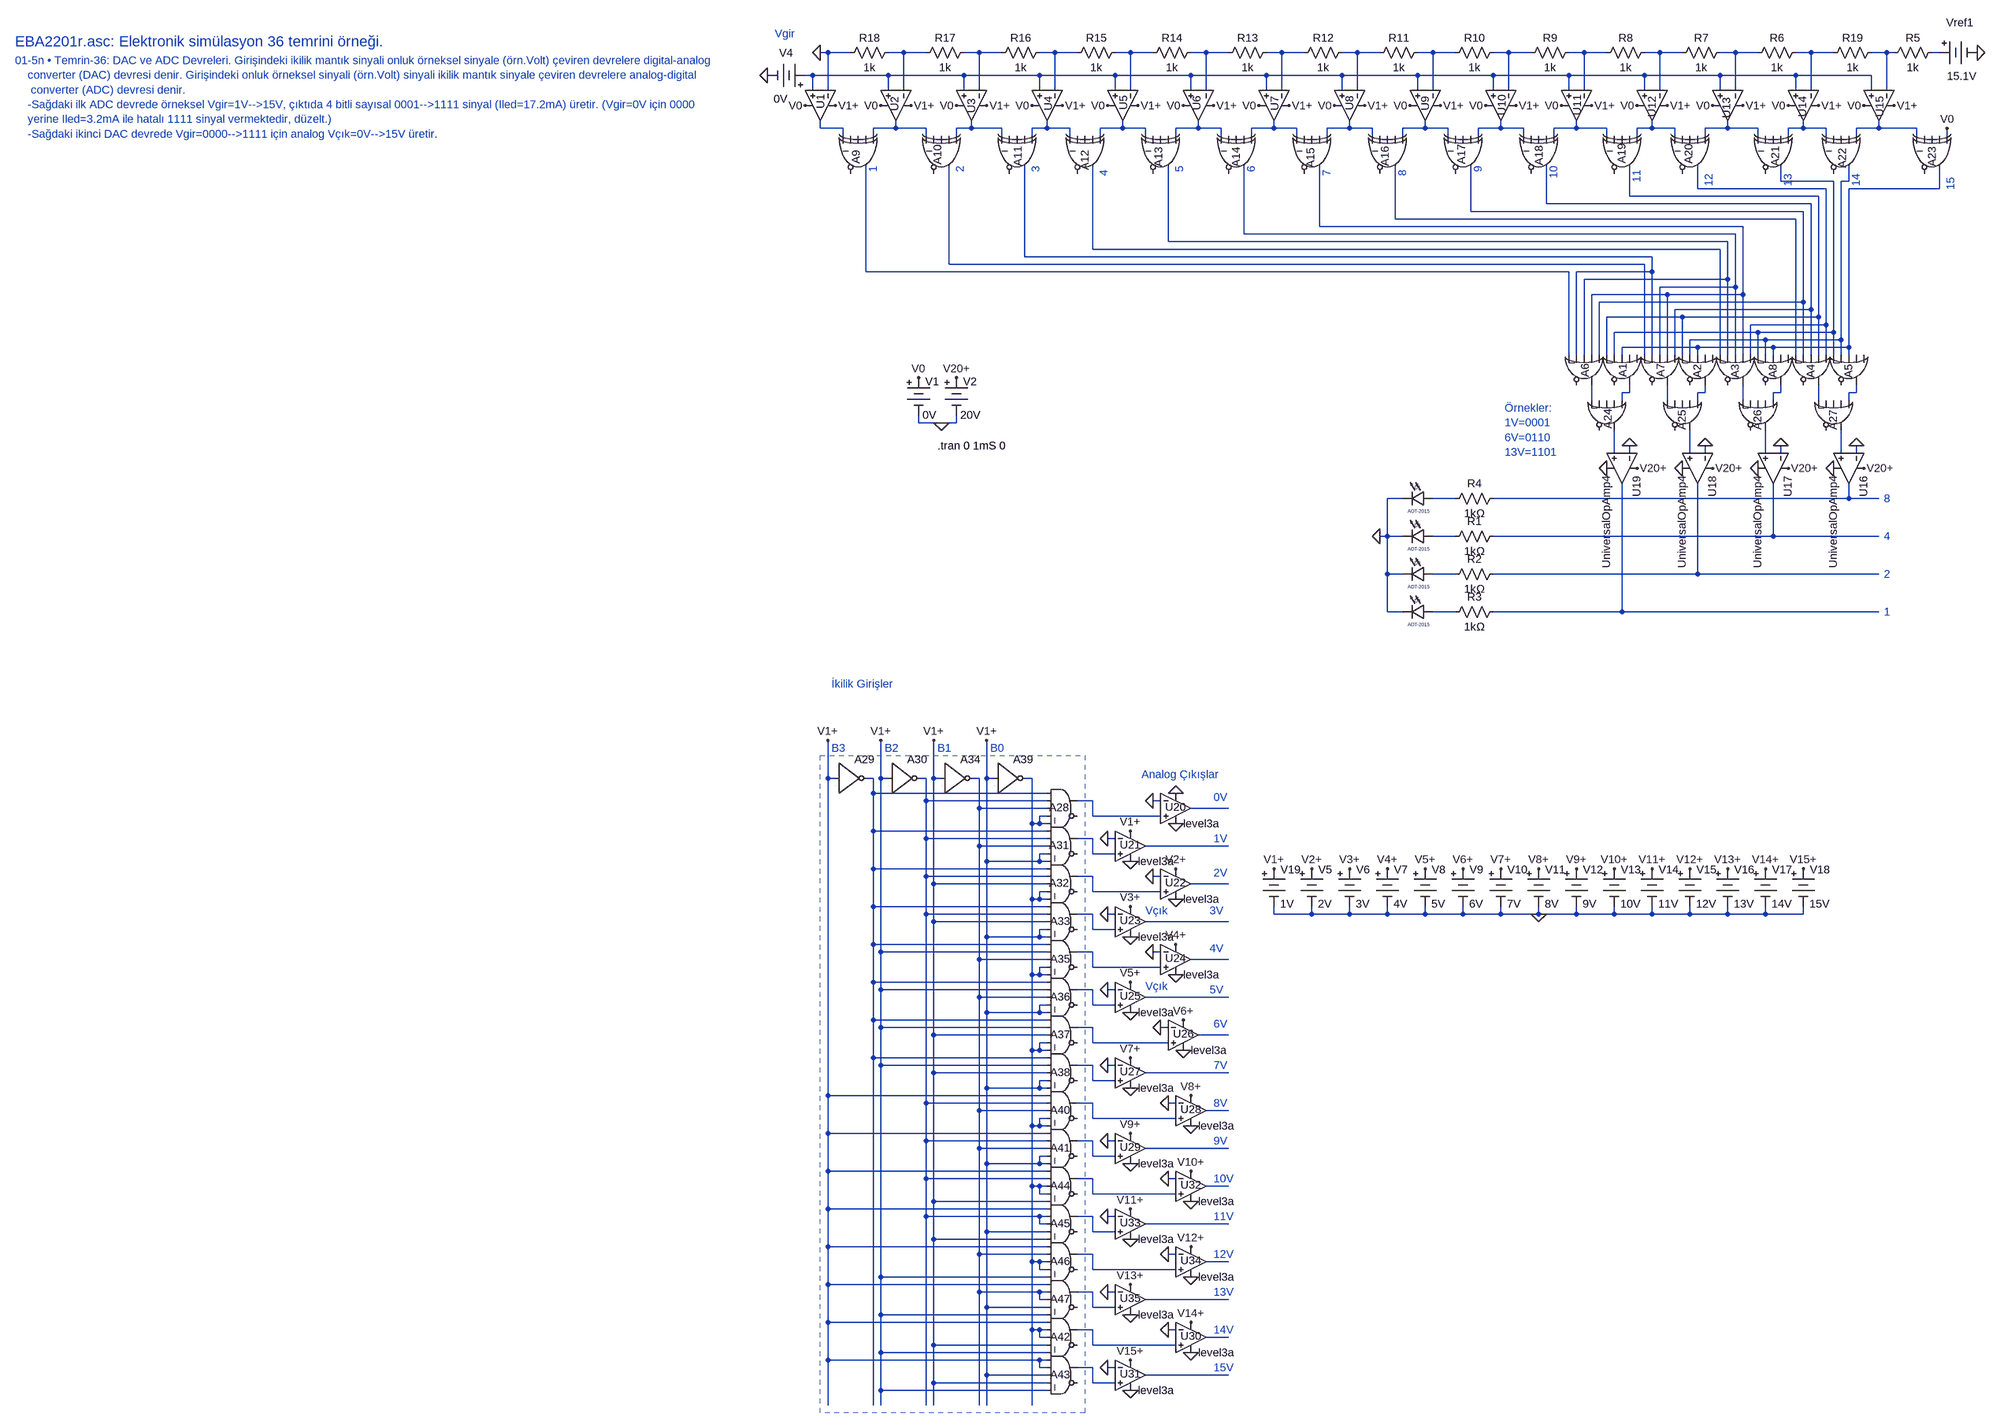
[diagram p0: schematic EBA2201r.asc]
EBA2201r.asc, the LTspice schematic file:
Version 4
SHEET 1 7064 4332
WIRE 1776 80 1760 80
WIRE 1824 80 1776 80
WIRE 1936 80 1904 80
WIRE 1984 80 1936 80
WIRE 2096 80 2064 80
WIRE 2144 80 2096 80
WIRE 2256 80 2224 80
WIRE 2304 80 2256 80
WIRE 2416 80 2384 80
WIRE 2464 80 2416 80
WIRE 2576 80 2544 80
WIRE 2624 80 2576 80
WIRE 2736 80 2704 80
WIRE 2784 80 2736 80
WIRE 2896 80 2864 80
WIRE 2944 80 2896 80
WIRE 3056 80 3024 80
WIRE 3104 80 3056 80
WIRE 3216 80 3184 80
WIRE 3264 80 3216 80
WIRE 3376 80 3344 80
WIRE 3424 80 3376 80
WIRE 3536 80 3504 80
WIRE 3584 80 3536 80
WIRE 3696 80 3664 80
WIRE 3744 80 3696 80
WIRE 3856 80 3824 80
WIRE 3904 80 3856 80
WIRE 4016 80 3984 80
WIRE 4032 80 4016 80
WIRE 4128 80 4112 80
WIRE 1744 128 1728 128
WIRE 1904 128 1744 128
WIRE 2064 128 1904 128
WIRE 2224 128 2064 128
WIRE 2384 128 2224 128
WIRE 2544 128 2384 128
WIRE 2704 128 2544 128
WIRE 2864 128 2704 128
WIRE 3024 128 2864 128
WIRE 3184 128 3024 128
WIRE 3344 128 3184 128
WIRE 3504 128 3344 128
WIRE 3664 128 3504 128
WIRE 3824 128 3664 128
WIRE 3984 128 3824 128
WIRE 1744 160 1744 128
WIRE 1776 160 1776 80
WIRE 1904 160 1904 128
WIRE 1936 160 1936 80
WIRE 2064 160 2064 128
WIRE 2096 160 2096 80
WIRE 2224 160 2224 128
WIRE 2256 160 2256 80
WIRE 2384 160 2384 128
WIRE 2416 160 2416 80
WIRE 2544 160 2544 128
WIRE 2576 160 2576 80
WIRE 2704 160 2704 128
WIRE 2736 160 2736 80
WIRE 2864 160 2864 128
WIRE 2896 160 2896 80
WIRE 3024 160 3024 128
WIRE 3056 160 3056 80
WIRE 3184 160 3184 128
WIRE 3216 160 3216 80
WIRE 3344 160 3344 128
WIRE 3376 160 3376 80
WIRE 3504 160 3504 128
WIRE 3536 160 3536 80
WIRE 3664 160 3664 128
WIRE 3696 160 3696 80
WIRE 3824 160 3824 128
WIRE 3856 160 3856 80
WIRE 3984 160 3984 128
WIRE 4016 160 4016 80
WIRE 1760 240 1760 224
WIRE 1808 240 1760 240
WIRE 1920 240 1920 224
WIRE 1920 240 1872 240
WIRE 1984 240 1920 240
WIRE 2080 240 2080 224
WIRE 2080 240 2048 240
WIRE 2144 240 2080 240
WIRE 2240 240 2240 224
WIRE 2240 240 2208 240
WIRE 2288 240 2240 240
WIRE 2400 240 2400 224
WIRE 2400 240 2352 240
WIRE 2448 240 2400 240
WIRE 2560 240 2560 224
WIRE 2560 240 2512 240
WIRE 2608 240 2560 240
WIRE 2720 240 2720 224
WIRE 2720 240 2672 240
WIRE 2768 240 2720 240
WIRE 2880 240 2880 224
WIRE 2880 240 2832 240
WIRE 2928 240 2880 240
WIRE 3040 240 3040 224
WIRE 3040 240 2992 240
WIRE 3088 240 3040 240
WIRE 3200 240 3200 224
WIRE 3200 240 3152 240
WIRE 3248 240 3200 240
WIRE 3360 240 3360 224
WIRE 3360 240 3312 240
WIRE 3424 240 3360 240
WIRE 3520 240 3520 224
WIRE 3520 240 3488 240
WIRE 3568 240 3520 240
WIRE 3680 240 3680 224
WIRE 3680 240 3632 240
WIRE 3744 240 3680 240
WIRE 3840 240 3840 224
WIRE 3840 240 3808 240
WIRE 3888 240 3840 240
WIRE 4000 240 4000 224
WIRE 4000 240 3952 240
WIRE 4080 240 4000 240
WIRE 1808 256 1808 240
WIRE 1872 256 1872 240
WIRE 1984 256 1984 240
WIRE 2048 256 2048 240
WIRE 2144 256 2144 240
WIRE 2208 256 2208 240
WIRE 2288 256 2288 240
WIRE 2352 256 2352 240
WIRE 2448 256 2448 240
WIRE 2512 256 2512 240
WIRE 2608 256 2608 240
WIRE 2672 256 2672 240
WIRE 2768 256 2768 240
WIRE 2832 256 2832 240
WIRE 2928 256 2928 240
WIRE 2992 256 2992 240
WIRE 3088 256 3088 240
WIRE 3152 256 3152 240
WIRE 3248 256 3248 240
WIRE 3312 256 3312 240
WIRE 3424 256 3424 240
WIRE 3488 256 3488 240
WIRE 3568 256 3568 240
WIRE 3632 256 3632 240
WIRE 3744 256 3744 240
WIRE 3808 256 3808 240
WIRE 3888 256 3888 240
WIRE 3952 256 3952 240
WIRE 4080 256 4080 240
WIRE 4144 256 4144 240
WIRE 3792 352 3792 320
WIRE 3904 352 3792 352
WIRE 3936 352 3936 320
WIRE 3936 352 3920 352
WIRE 3616 368 3616 320
WIRE 3888 368 3616 368
WIRE 4128 368 4128 320
WIRE 4128 368 3936 368
WIRE 3472 384 3472 320
WIRE 3872 384 3472 384
WIRE 3296 400 3296 320
WIRE 3856 400 3296 400
WIRE 3136 416 3136 320
WIRE 3840 416 3136 416
WIRE 2976 432 2976 320
WIRE 3824 432 2976 432
WIRE 2816 448 2816 320
WIRE 3712 448 2816 448
WIRE 2656 464 2656 320
WIRE 3696 464 2656 464
WIRE 2496 480 2496 320
WIRE 3680 480 2496 480
WIRE 2336 496 2336 320
WIRE 3664 496 2336 496
WIRE 2192 512 2192 320
WIRE 3520 512 2192 512
WIRE 2032 528 2032 320
WIRE 3504 528 2032 528
WIRE 1856 544 1856 320
WIRE 3344 544 1856 544
WIRE 3520 544 3520 512
WIRE 3520 544 3360 544
WIRE 3680 560 3680 480
WIRE 3680 560 3376 560
WIRE 3696 576 3696 464
WIRE 3696 576 3536 576
WIRE 3552 592 3392 592
WIRE 3712 592 3712 448
WIRE 3712 592 3552 592
WIRE 3840 608 3840 416
WIRE 3840 608 3408 608
WIRE 3856 624 3856 400
WIRE 3856 624 3568 624
WIRE 3584 640 3424 640
WIRE 3872 640 3872 384
WIRE 3872 640 3584 640
WIRE 3888 656 3888 368
WIRE 3888 656 3728 656
WIRE 3744 672 3440 672
WIRE 3904 672 3904 352
WIRE 3904 672 3744 672
WIRE 3760 688 3600 688
WIRE 3920 688 3920 352
WIRE 3920 688 3760 688
WIRE 3616 704 3456 704
WIRE 3776 704 3616 704
WIRE 3936 704 3936 368
WIRE 3936 704 3776 704
WIRE 3344 720 3344 544
WIRE 3360 720 3360 544
WIRE 3376 720 3376 560
WIRE 3392 720 3392 592
WIRE 3408 720 3408 608
WIRE 3424 720 3424 640
WIRE 3440 720 3440 672
WIRE 3456 720 3456 704
WIRE 3504 720 3504 528
WIRE 3520 720 3520 544
WIRE 3536 720 3536 576
WIRE 3552 720 3552 592
WIRE 3568 720 3568 624
WIRE 3584 720 3584 640
WIRE 3600 720 3600 688
WIRE 3616 720 3616 704
WIRE 3664 720 3664 496
WIRE 3680 720 3680 560
WIRE 3696 720 3696 576
WIRE 3712 720 3712 592
WIRE 3728 720 3728 656
WIRE 3744 720 3744 672
WIRE 3760 720 3760 688
WIRE 3776 720 3776 704
WIRE 3824 720 3824 432
WIRE 3840 720 3840 608
WIRE 3856 720 3856 624
WIRE 3872 720 3872 640
WIRE 3888 720 3888 656
WIRE 3904 720 3904 672
WIRE 3920 720 3920 688
WIRE 3936 720 3936 704
WIRE 3472 800 3472 784
WIRE 3472 800 3456 800
WIRE 3632 800 3632 784
WIRE 3632 800 3616 800
WIRE 3792 800 3792 784
WIRE 3792 800 3776 800
WIRE 3952 800 3952 784
WIRE 3952 800 3936 800
WIRE 3392 816 3392 784
WIRE 3456 816 3456 800
WIRE 3552 816 3552 784
WIRE 3616 816 3616 800
WIRE 3712 816 3712 784
WIRE 3776 816 3776 800
WIRE 3872 816 3872 784
WIRE 3936 816 3936 800
WIRE 1968 864 1968 848
WIRE 2016 864 1968 864
WIRE 2048 864 2048 848
WIRE 2048 864 2016 864
WIRE 3440 928 3440 880
WIRE 3472 928 3472 912
WIRE 3600 928 3600 880
WIRE 3632 928 3632 912
WIRE 3760 928 3760 880
WIRE 3792 928 3792 912
WIRE 3920 928 3920 880
WIRE 3952 928 3952 912
WIRE 2992 1024 2960 1024
WIRE 3104 1024 3056 1024
WIRE 3936 1024 3936 992
WIRE 3936 1024 3184 1024
WIRE 4000 1024 3936 1024
WIRE 2960 1104 2960 1024
WIRE 2960 1104 2944 1104
WIRE 2992 1104 2960 1104
WIRE 3104 1104 3056 1104
WIRE 3776 1104 3776 992
WIRE 3776 1104 3184 1104
WIRE 4000 1104 3776 1104
WIRE 2960 1184 2960 1104
WIRE 2992 1184 2960 1184
WIRE 3104 1184 3056 1184
WIRE 3616 1184 3616 992
WIRE 3616 1184 3184 1184
WIRE 4000 1184 3616 1184
WIRE 2960 1264 2960 1184
WIRE 2992 1264 2960 1264
WIRE 3104 1264 3056 1264
WIRE 3456 1264 3456 992
WIRE 3456 1264 3184 1264
WIRE 4000 1264 3456 1264
WIRE 1776 1616 1776 1536
WIRE 1792 1616 1776 1616
WIRE 1872 1616 1856 1616
WIRE 1888 1616 1888 1536
WIRE 1904 1616 1888 1616
WIRE 1984 1616 1968 1616
WIRE 2000 1616 2000 1536
WIRE 2016 1616 2000 1616
WIRE 2096 1616 2080 1616
WIRE 2112 1616 2112 1536
WIRE 2128 1616 2112 1616
WIRE 2208 1616 2192 1616
WIRE 1872 1648 1872 1616
WIRE 2240 1648 1872 1648
WIRE 1984 1664 1984 1616
WIRE 2240 1664 1984 1664
WIRE 2336 1664 2304 1664
WIRE 2480 1664 2464 1664
WIRE 2096 1680 2096 1616
WIRE 2240 1680 2096 1680
WIRE 2624 1680 2544 1680
WIRE 2240 1696 2224 1696
WIRE 2336 1696 2336 1664
WIRE 2480 1696 2336 1696
WIRE 2208 1712 2208 1616
WIRE 2224 1712 2224 1696
WIRE 2224 1712 2208 1712
WIRE 2240 1712 2224 1712
WIRE 1872 1728 1872 1648
WIRE 2240 1728 1872 1728
WIRE 1984 1744 1984 1664
WIRE 2240 1744 1984 1744
WIRE 2336 1744 2304 1744
WIRE 2384 1744 2368 1744
WIRE 2096 1760 2096 1680
WIRE 2240 1760 2096 1760
WIRE 2624 1760 2448 1760
WIRE 2240 1776 2224 1776
WIRE 2336 1776 2336 1744
WIRE 2384 1776 2336 1776
WIRE 2112 1792 2112 1616
WIRE 2224 1792 2224 1776
WIRE 2224 1792 2112 1792
WIRE 2240 1792 2224 1792
WIRE 1872 1808 1872 1728
WIRE 2240 1808 1872 1808
WIRE 1984 1824 1984 1744
WIRE 2240 1824 1984 1824
WIRE 2336 1824 2304 1824
WIRE 2480 1824 2464 1824
WIRE 2000 1840 2000 1616
WIRE 2240 1840 2000 1840
WIRE 2624 1840 2544 1840
WIRE 2240 1856 2224 1856
WIRE 2336 1856 2336 1824
WIRE 2480 1856 2336 1856
WIRE 2208 1872 2208 1712
WIRE 2224 1872 2224 1856
WIRE 2224 1872 2208 1872
WIRE 2240 1872 2224 1872
WIRE 1872 1888 1872 1808
WIRE 2240 1888 1872 1888
WIRE 1984 1904 1984 1824
WIRE 2240 1904 1984 1904
WIRE 2336 1904 2304 1904
WIRE 2384 1904 2368 1904
WIRE 2720 1904 2720 1888
WIRE 2800 1904 2800 1888
WIRE 2800 1904 2720 1904
WIRE 2880 1904 2880 1888
WIRE 2880 1904 2800 1904
WIRE 2960 1904 2960 1888
WIRE 2960 1904 2880 1904
WIRE 3040 1904 3040 1888
WIRE 3040 1904 2960 1904
WIRE 3120 1904 3120 1888
WIRE 3120 1904 3040 1904
WIRE 3200 1904 3200 1888
WIRE 3200 1904 3120 1904
WIRE 3280 1904 3280 1888
WIRE 3280 1904 3200 1904
WIRE 3360 1904 3360 1888
WIRE 3360 1904 3280 1904
WIRE 3440 1904 3440 1888
WIRE 3440 1904 3360 1904
WIRE 3520 1904 3520 1888
WIRE 3520 1904 3440 1904
WIRE 3600 1904 3600 1888
WIRE 3600 1904 3520 1904
WIRE 3680 1904 3680 1888
WIRE 3680 1904 3600 1904
WIRE 3760 1904 3760 1888
WIRE 3760 1904 3680 1904
WIRE 3840 1904 3840 1888
WIRE 3840 1904 3760 1904
WIRE 2000 1920 2000 1840
WIRE 2240 1920 2000 1920
WIRE 2624 1920 2448 1920
WIRE 2240 1936 2224 1936
WIRE 2336 1936 2336 1904
WIRE 2384 1936 2336 1936
WIRE 2112 1952 2112 1792
WIRE 2224 1952 2224 1936
WIRE 2224 1952 2112 1952
WIRE 2240 1952 2224 1952
WIRE 1872 1968 1872 1888
WIRE 2240 1968 1872 1968
WIRE 1888 1984 1888 1616
WIRE 2240 1984 1888 1984
WIRE 2336 1984 2304 1984
WIRE 2480 1984 2464 1984
WIRE 2096 2000 2096 1760
WIRE 2240 2000 2096 2000
WIRE 2624 2000 2544 2000
WIRE 2240 2016 2224 2016
WIRE 2336 2016 2336 1984
WIRE 2480 2016 2336 2016
WIRE 2208 2032 2208 1872
WIRE 2224 2032 2224 2016
WIRE 2224 2032 2208 2032
WIRE 2240 2032 2224 2032
WIRE 1872 2048 1872 1968
WIRE 2240 2048 1872 2048
WIRE 1888 2064 1888 1984
WIRE 2240 2064 1888 2064
WIRE 2336 2064 2304 2064
WIRE 2384 2064 2368 2064
WIRE 2096 2080 2096 2000
WIRE 2240 2080 2096 2080
WIRE 2624 2080 2448 2080
WIRE 2240 2096 2224 2096
WIRE 2336 2096 2336 2064
WIRE 2384 2096 2336 2096
WIRE 2112 2112 2112 1952
WIRE 2224 2112 2224 2096
WIRE 2224 2112 2112 2112
WIRE 2240 2112 2224 2112
WIRE 1872 2128 1872 2048
WIRE 2240 2128 1872 2128
WIRE 1888 2144 1888 2064
WIRE 2240 2144 1888 2144
WIRE 2336 2144 2304 2144
WIRE 2496 2144 2480 2144
WIRE 2000 2160 2000 1920
WIRE 2240 2160 2000 2160
WIRE 2624 2160 2560 2160
WIRE 2240 2176 2224 2176
WIRE 2336 2176 2336 2144
WIRE 2496 2176 2336 2176
WIRE 2208 2192 2208 2032
WIRE 2224 2192 2224 2176
WIRE 2224 2192 2208 2192
WIRE 2240 2192 2224 2192
WIRE 1872 2208 1872 2128
WIRE 2240 2208 1872 2208
WIRE 1888 2224 1888 2144
WIRE 2240 2224 1888 2224
WIRE 2336 2224 2304 2224
WIRE 2384 2224 2368 2224
WIRE 2000 2240 2000 2160
WIRE 2240 2240 2000 2240
WIRE 2624 2240 2448 2240
WIRE 2240 2256 2224 2256
WIRE 2336 2256 2336 2224
WIRE 2384 2256 2336 2256
WIRE 2112 2272 2112 2112
WIRE 2224 2272 2224 2256
WIRE 2224 2272 2112 2272
WIRE 2240 2272 2224 2272
WIRE 1776 2288 1776 1616
WIRE 2240 2288 1776 2288
WIRE 1984 2304 1984 1904
WIRE 2240 2304 1984 2304
WIRE 2336 2304 2304 2304
WIRE 2512 2304 2496 2304
WIRE 2096 2320 2096 2080
WIRE 2240 2320 2096 2320
WIRE 2624 2320 2576 2320
WIRE 2240 2336 2224 2336
WIRE 2336 2336 2336 2304
WIRE 2512 2336 2336 2336
WIRE 2208 2352 2208 2192
WIRE 2224 2352 2224 2336
WIRE 2224 2352 2208 2352
WIRE 2240 2352 2224 2352
WIRE 1776 2368 1776 2288
WIRE 2240 2368 1776 2368
WIRE 1984 2384 1984 2304
WIRE 2240 2384 1984 2384
WIRE 2336 2384 2304 2384
WIRE 2384 2384 2368 2384
WIRE 2096 2400 2096 2320
WIRE 2240 2400 2096 2400
WIRE 2624 2400 2448 2400
WIRE 2240 2416 2224 2416
WIRE 2336 2416 2336 2384
WIRE 2384 2416 2336 2416
WIRE 2112 2432 2112 2272
WIRE 2224 2432 2224 2416
WIRE 2224 2432 2112 2432
WIRE 2240 2432 2224 2432
WIRE 1776 2448 1776 2368
WIRE 2240 2448 1776 2448
WIRE 1984 2464 1984 2384
WIRE 2240 2464 1984 2464
WIRE 2336 2464 2304 2464
WIRE 2512 2464 2496 2464
WIRE 2208 2480 2208 2352
WIRE 2224 2480 2208 2480
WIRE 2240 2480 2224 2480
WIRE 2624 2480 2576 2480
WIRE 2224 2496 2224 2480
WIRE 2240 2496 2224 2496
WIRE 2336 2496 2336 2464
WIRE 2512 2496 2336 2496
WIRE 2000 2512 2000 2240
WIRE 2240 2512 2000 2512
WIRE 1776 2528 1776 2448
WIRE 2240 2528 1776 2528
WIRE 1984 2544 1984 2464
WIRE 2224 2544 1984 2544
WIRE 2240 2544 2224 2544
WIRE 2336 2544 2304 2544
WIRE 2384 2544 2368 2544
WIRE 2224 2560 2224 2544
WIRE 2240 2560 2224 2560
WIRE 2624 2560 2448 2560
WIRE 2112 2576 2112 2432
WIRE 2240 2576 2112 2576
WIRE 2336 2576 2336 2544
WIRE 2384 2576 2336 2576
WIRE 2000 2592 2000 2512
WIRE 2240 2592 2000 2592
WIRE 1776 2608 1776 2528
WIRE 2240 2608 1776 2608
WIRE 2096 2624 2096 2400
WIRE 2240 2624 2096 2624
WIRE 2336 2624 2304 2624
WIRE 2512 2624 2496 2624
WIRE 2208 2640 2208 2480
WIRE 2224 2640 2208 2640
WIRE 2240 2640 2224 2640
WIRE 2624 2640 2576 2640
WIRE 2224 2656 2224 2640
WIRE 2240 2656 2224 2656
WIRE 2336 2656 2336 2624
WIRE 2512 2656 2336 2656
WIRE 1888 2672 1888 2224
WIRE 2240 2672 1888 2672
WIRE 1776 2688 1776 2608
WIRE 2240 2688 1776 2688
WIRE 2096 2704 2096 2624
WIRE 2224 2704 2096 2704
WIRE 2240 2704 2224 2704
WIRE 2336 2704 2304 2704
WIRE 2384 2704 2368 2704
WIRE 2224 2720 2224 2704
WIRE 2240 2720 2224 2720
WIRE 2624 2720 2448 2720
WIRE 2112 2736 2112 2576
WIRE 2240 2736 2112 2736
WIRE 2336 2736 2336 2704
WIRE 2384 2736 2336 2736
WIRE 1888 2752 1888 2672
WIRE 2240 2752 1888 2752
WIRE 1776 2768 1776 2688
WIRE 2240 2768 1776 2768
WIRE 2208 2784 2208 2640
WIRE 2224 2784 2208 2784
WIRE 2240 2784 2224 2784
WIRE 2336 2784 2304 2784
WIRE 2512 2784 2496 2784
WIRE 2224 2800 2224 2784
WIRE 2240 2800 2224 2800
WIRE 2624 2800 2576 2800
WIRE 2000 2816 2000 2592
WIRE 2240 2816 2000 2816
WIRE 2336 2816 2336 2784
WIRE 2512 2816 2336 2816
WIRE 1888 2832 1888 2752
WIRE 2240 2832 1888 2832
WIRE 1776 2848 1776 2768
WIRE 2224 2848 1776 2848
WIRE 2240 2848 2224 2848
WIRE 2224 2864 2224 2848
WIRE 2240 2864 2224 2864
WIRE 2336 2864 2304 2864
WIRE 2384 2864 2368 2864
WIRE 2112 2880 2112 2736
WIRE 2240 2880 2112 2880
WIRE 2624 2880 2448 2880
WIRE 2000 2896 2000 2816
WIRE 2240 2896 2000 2896
WIRE 2336 2896 2336 2864
WIRE 2384 2896 2336 2896
WIRE 1888 2912 1888 2832
WIRE 2240 2912 1888 2912
WIRE 1776 2944 1776 2848
WIRE 1872 2944 1872 2208
WIRE 1888 2944 1888 2912
WIRE 1984 2944 1984 2544
WIRE 2000 2944 2000 2896
WIRE 2096 2944 2096 2704
WIRE 2112 2944 2112 2880
WIRE 2208 2944 2208 2784
FLAG 2016 864 0
FLAG 2048 768 V20+
FLAG 1968 768 V0
FLAG 2944 1104 0
FLAG 1760 80 0
FLAG 4208 80 0
FLAG 1648 128 0
FLAG 1728 192 V0
FLAG 1888 192 V0
FLAG 2048 192 V0
FLAG 2208 192 V0
FLAG 2368 192 V0
FLAG 2528 192 V0
FLAG 2688 192 V0
FLAG 2848 192 V0
FLAG 3008 192 V0
FLAG 3168 192 V0
FLAG 3328 192 V0
FLAG 3488 192 V0
FLAG 3648 192 V0
FLAG 3808 192 V0
FLAG 3968 192 V0
FLAG 4032 192 V1+
FLAG 3872 192 V1+
FLAG 3712 192 V1+
FLAG 3552 192 V1+
FLAG 3392 192 V1+
FLAG 3232 192 V1+
FLAG 3072 192 V1+
FLAG 2912 192 V1+
FLAG 2752 192 V1+
FLAG 2592 192 V1+
FLAG 2432 192 V1+
FLAG 2272 192 V1+
FLAG 2112 192 V1+
FLAG 1952 192 V1+
FLAG 1792 192 V1+
FLAG 4144 240 V0
FLAG 3904 960 0
FLAG 3744 960 0
FLAG 3584 960 0
FLAG 3424 960 0
FLAG 3488 960 V20+
FLAG 3952 912 0
FLAG 3792 912 0
FLAG 3632 912 0
FLAG 3472 912 0
FLAG 3648 960 V20+
FLAG 3808 960 V20+
FLAG 3968 960 V20+
FLAG 1776 1536 V1+
FLAG 2464 1664 0
FLAG 2512 1712 0
FLAG 2112 1536 V1+
FLAG 2368 1744 0
FLAG 2416 1792 0
FLAG 2512 1872 0
FLAG 2368 1904 0
FLAG 2416 1952 0
FLAG 2464 1984 0
FLAG 2512 2032 0
FLAG 2368 2064 0
FLAG 2416 2112 0
FLAG 2480 2144 0
FLAG 2528 2192 0
FLAG 2368 2224 0
FLAG 2416 2272 0
FLAG 2496 2304 0
FLAG 2544 2352 0
FLAG 2368 2384 0
FLAG 2416 2432 0
FLAG 2512 1648 0
FLAG 2416 1728 V1+
FLAG 2512 1808 V2+
FLAG 2416 1888 V3+
FLAG 2512 1968 V4+
FLAG 2416 2048 V5+
FLAG 2528 2128 V6+
FLAG 2416 2208 V7+
FLAG 2544 2288 V8+
FLAG 2416 2368 V9+
FLAG 2496 2784 0
FLAG 2544 2832 0
FLAG 2368 2864 0
FLAG 2416 2912 0
FLAG 2544 2768 V14+
FLAG 2416 2848 V15+
FLAG 2496 2464 0
FLAG 2544 2512 0
FLAG 2368 2544 0
FLAG 2416 2592 0
FLAG 2544 2448 V10+
FLAG 2416 2528 V11+
FLAG 2496 2624 0
FLAG 2544 2672 0
FLAG 2368 2704 0
FLAG 2416 2752 0
FLAG 2544 2608 V12+
FLAG 2416 2688 V13+
FLAG 1888 1536 V1+
FLAG 2720 1808 V1+
FLAG 2800 1808 V2+
FLAG 2880 1808 V3+
FLAG 2960 1808 V4+
FLAG 3040 1808 V5+
FLAG 3120 1808 V6+
FLAG 3200 1808 V7+
FLAG 3280 1808 V8+
FLAG 3360 1808 V9+
FLAG 3280 1904 0
FLAG 3440 1808 V10+
FLAG 3520 1808 V11+
FLAG 3600 1808 V12+
FLAG 3680 1808 V13+
FLAG 3760 1808 V14+
FLAG 3840 1808 V15+
FLAG 2464 1824 0
FLAG 2000 1536 V1+
SYMBOL Misc\\battery 2048 752 R0
WINDOW 3 8 95 Left 2
WINDOW 0 14 24 Left 2
SYMATTR Value 20V
SYMATTR InstName V2
SYMBOL Misc\\battery 1968 752 R0
WINDOW 3 8 95 Left 2
WINDOW 0 14 24 Left 2
SYMATTR Value 0V
SYMATTR InstName V1
SYMBOL res 3200 1088 R90
WINDOW 0 0 56 VBottom 2
WINDOW 3 32 56 VTop 2
SYMATTR InstName R1
SYMATTR Value 1kΩ
SYMBOL res 3200 1168 R90
WINDOW 0 0 56 VBottom 2
WINDOW 3 32 56 VTop 2
SYMATTR InstName R2
SYMATTR Value 1kΩ
SYMBOL res 3200 1248 R90
WINDOW 0 0 56 VBottom 2
WINDOW 3 32 56 VTop 2
SYMATTR InstName R3
SYMATTR Value 1kΩ
SYMBOL res 3200 1008 R90
WINDOW 0 0 56 VBottom 2
WINDOW 3 32 56 VTop 2
SYMATTR InstName R4
SYMATTR Value 1kΩ
SYMBOL Digital\\or 3520 752 R90
WINDOW 0 -14 61 Left 2
SYMATTR InstName A1
SYMBOL Digital\\or 3680 752 R90
WINDOW 0 -12 64 Left 2
SYMATTR InstName A2
SYMBOL Digital\\or 3760 752 R90
WINDOW 0 -12 64 Left 2
SYMATTR InstName A3
SYMBOL Digital\\or 3920 752 R90
WINDOW 0 -12 64 Left 2
SYMATTR InstName A4
SYMBOL Digital\\or 4000 752 R90
WINDOW 0 -12 64 Left 2
SYMATTR InstName A5
SYMBOL Digital\\or 3440 752 R90
WINDOW 0 -14 61 Left 2
SYMATTR InstName A6
SYMBOL Digital\\or 3600 752 R90
WINDOW 0 -14 61 Left 2
SYMATTR InstName A7
SYMBOL Digital\\or 3840 752 R90
WINDOW 0 -12 64 Left 2
SYMATTR InstName A8
SYMBOL res 4128 64 R90
WINDOW 0 0 56 VBottom 2
WINDOW 3 32 56 VTop 2
SYMATTR InstName R5
SYMATTR Value 1k
SYMBOL res 3840 64 R90
WINDOW 0 0 56 VBottom 2
WINDOW 3 32 56 VTop 2
SYMATTR InstName R6
SYMATTR Value 1k
SYMBOL res 3680 64 R90
WINDOW 0 0 56 VBottom 2
WINDOW 3 32 56 VTop 2
SYMATTR InstName R7
SYMATTR Value 1k
SYMBOL res 3520 64 R90
WINDOW 0 0 56 VBottom 2
WINDOW 3 32 56 VTop 2
SYMATTR InstName R8
SYMATTR Value 1k
SYMBOL res 3360 64 R90
WINDOW 0 0 56 VBottom 2
WINDOW 3 32 56 VTop 2
SYMATTR InstName R9
SYMATTR Value 1k
SYMBOL res 3200 64 R90
WINDOW 0 0 56 VBottom 2
WINDOW 3 32 56 VTop 2
SYMATTR InstName R10
SYMATTR Value 1k
SYMBOL res 3040 64 R90
WINDOW 0 0 56 VBottom 2
WINDOW 3 32 56 VTop 2
SYMATTR InstName R11
SYMATTR Value 1k
SYMBOL res 2880 64 R90
WINDOW 0 0 56 VBottom 2
WINDOW 3 32 56 VTop 2
SYMATTR InstName R12
SYMATTR Value 1k
SYMBOL res 2720 64 R90
WINDOW 0 0 56 VBottom 2
WINDOW 3 32 56 VTop 2
SYMATTR InstName R13
SYMATTR Value 1k
SYMBOL res 2560 64 R90
WINDOW 0 0 56 VBottom 2
WINDOW 3 32 56 VTop 2
SYMATTR InstName R14
SYMATTR Value 1k
SYMBOL res 2400 64 R90
WINDOW 0 0 56 VBottom 2
WINDOW 3 32 56 VTop 2
SYMATTR InstName R15
SYMATTR Value 1k
SYMBOL res 2240 64 R90
WINDOW 0 0 56 VBottom 2
WINDOW 3 32 56 VTop 2
SYMATTR InstName R16
SYMATTR Value 1k
SYMBOL res 2080 64 R90
WINDOW 0 0 56 VBottom 2
WINDOW 3 32 56 VTop 2
SYMATTR InstName R17
SYMATTR Value 1k
SYMBOL res 1920 64 R90
WINDOW 0 0 56 VBottom 2
WINDOW 3 32 56 VTop 2
SYMATTR InstName R18
SYMATTR Value 1k
SYMBOL Misc\\battery 4112 80 M90
WINDOW 0 -64 88 VLeft 2
WINDOW 3 50 95 VLeft 2
WINDOW 123 0 0 Left 0
WINDOW 39 0 0 Left 0
SYMATTR InstName Vref1
SYMATTR Value 15.1V
SYMBOL res 4000 64 R90
WINDOW 0 0 56 VBottom 2
WINDOW 3 32 56 VTop 2
SYMATTR InstName R19
SYMATTR Value 1k
SYMBOL Misc\\battery 1744 128 M270
WINDOW 0 32 56 VTop 2
WINDOW 3 -34 68 VBottom 2
WINDOW 123 0 0 Left 0
WINDOW 39 0 0 Left 0
SYMATTR InstName V4
SYMATTR Value 0V
SYMBOL OpAmps\\UniversalOpAmp 1760 192 R90
WINDOW 0 -23 -1 Left 2
SYMATTR InstName U1
SYMBOL OpAmps\\UniversalOpAmp 1920 192 R90
WINDOW 0 -18 2 Left 2
SYMATTR InstName U2
SYMBOL OpAmps\\UniversalOpAmp 2080 192 R90
WINDOW 0 -14 0 Left 2
SYMATTR InstName U3
SYMBOL OpAmps\\UniversalOpAmp 2240 192 R90
WINDOW 0 -19 -3 Left 2
SYMATTR InstName U4
SYMBOL OpAmps\\UniversalOpAmp 2400 192 R90
WINDOW 0 -21 -2 Left 2
SYMATTR InstName U5
SYMBOL OpAmps\\UniversalOpAmp 2560 192 R90
WINDOW 0 -20 3 Left 2
SYMATTR InstName U6
SYMBOL OpAmps\\UniversalOpAmp 2720 192 R90
WINDOW 0 -19 -2 Left 2
SYMATTR InstName U7
SYMBOL OpAmps\\UniversalOpAmp 2880 192 R90
WINDOW 0 -20 0 Left 2
SYMATTR InstName U8
SYMBOL OpAmps\\UniversalOpAmp 3040 192 R90
WINDOW 0 -19 0 Left 2
SYMATTR InstName U9
SYMBOL OpAmps\\UniversalOpAmp 3200 192 R90
WINDOW 0 -23 -3 Left 2
SYMATTR InstName U10
SYMBOL OpAmps\\UniversalOpAmp 3360 192 R90
WINDOW 0 -23 -2 Left 2
SYMATTR InstName U11
SYMBOL OpAmps\\UniversalOpAmp 3520 192 R90
WINDOW 0 -20 0 Left 2
SYMATTR InstName U12
SYMBOL OpAmps\\UniversalOpAmp 3680 192 R90
WINDOW 0 -17 2 Left 2
SYMATTR InstName U13
SYMBOL OpAmps\\UniversalOpAmp 3840 192 R90
WINDOW 0 -20 1 Left 2
SYMATTR InstName U14
SYMBOL OpAmps\\UniversalOpAmp 4000 192 R90
WINDOW 0 -20 -2 Left 2
SYMATTR InstName U15
SYMBOL Digital\\xor 1904 304 R90
WINDOW 0 -18 68 Left 2
SYMATTR InstName A9
SYMBOL Digital\\xor 2080 304 R90
WINDOW 0 -29 71 Left 2
SYMATTR InstName A10
SYMBOL Digital\\xor 2240 304 R90
WINDOW 0 -26 61 Left 2
SYMATTR InstName A11
SYMBOL Digital\\xor 2384 304 R90
WINDOW 0 -18 64 Left 2
SYMATTR InstName A12
SYMBOL Digital\\xor 2544 304 R90
WINDOW 0 -24 68 Left 2
SYMATTR InstName A13
SYMBOL Digital\\xor 2704 304 R90
WINDOW 0 -24 64 Left 2
SYMATTR InstName A14
SYMBOL Digital\\xor 2864 304 R90
WINDOW 0 -23 66 Left 2
SYMATTR InstName A15
SYMBOL Digital\\xor 3024 304 R90
WINDOW 0 -26 69 Left 2
SYMATTR InstName A16
SYMBOL Digital\\xor 3184 304 R90
WINDOW 0 -30 67 Left 2
SYMATTR InstName A17
SYMBOL Digital\\xor 3344 304 R90
WINDOW 0 -28 63 Left 2
SYMATTR InstName A18
SYMBOL Digital\\xor 3520 304 R90
WINDOW 0 -32 64 Left 2
SYMATTR InstName A19
SYMBOL Digital\\xor 3664 304 R90
WINDOW 0 -31 66 Left 2
SYMATTR InstName A20
SYMBOL Digital\\xor 3840 304 R90
WINDOW 0 -26 59 Left 2
SYMATTR InstName A21
SYMBOL Digital\\xor 3984 304 R90
WINDOW 0 -22 61 Left 2
SYMATTR InstName A22
SYMBOL Digital\\xor 4176 304 R90
WINDOW 0 -25 63 Left 2
SYMATTR InstName A23
SYMBOL Digital\\or 3488 848 R90
WINDOW 0 -14 61 Left 2
SYMATTR InstName A24
SYMBOL Digital\\or 3648 848 R90
WINDOW 0 -12 64 Left 2
SYMATTR InstName A25
SYMBOL Digital\\or 3808 848 R90
WINDOW 0 -12 64 Left 2
SYMATTR InstName A26
SYMBOL Digital\\or 3968 848 R90
WINDOW 0 -12 64 Left 2
SYMATTR InstName A27
SYMBOL LED 3056 1008 R90
WINDOW 0 0 32 VBottom 0
WINDOW 3 37 30 VTop 0
SYMATTR InstName D1
SYMATTR Value AOT-2015
SYMATTR Description Diode
SYMATTR Type diode
SYMBOL LED 3056 1088 R90
WINDOW 0 0 32 VBottom 0
WINDOW 3 37 30 VTop 0
SYMATTR InstName D2
SYMATTR Value AOT-2015
SYMATTR Description Diode
SYMATTR Type diode
SYMBOL LED 3056 1168 R90
WINDOW 0 0 32 VBottom 0
WINDOW 3 37 30 VTop 0
SYMATTR InstName D3
SYMATTR Value AOT-2015
SYMATTR Description Diode
SYMATTR Type diode
SYMBOL LED 3056 1248 R90
WINDOW 0 0 32 VBottom 0
WINDOW 3 37 30 VTop 0
SYMATTR InstName D4
SYMATTR Value AOT-2015
SYMATTR Description Diode
SYMATTR Type diode
SYMBOL OpAmps\\UniversalOpAmp4 3936 960 R90
SYMATTR InstName U16
SYMBOL OpAmps\\UniversalOpAmp4 3776 960 R90
SYMATTR InstName U17
SYMBOL OpAmps\\UniversalOpAmp4 3616 960 R90
SYMATTR InstName U18
SYMBOL OpAmps\\UniversalOpAmp4 3456 960 R90
SYMATTR InstName U19
SYMBOL Digital\\and 2272 1616 R0
WINDOW 0 -28 62 Left 2
SYMATTR InstName A28
SYMBOL Digital\\inv 1792 1552 R0
SYMATTR InstName A29
SYMBOL Digital\\inv 1904 1552 R0
SYMATTR InstName A30
SYMBOL Digital\\and 2272 1696 R0
WINDOW 0 -28 62 Left 2
SYMATTR InstName A31
SYMBOL Digital\\and 2272 1776 R0
WINDOW 0 -28 62 Left 2
SYMATTR InstName A32
SYMBOL Digital\\and 2272 1856 R0
WINDOW 0 -26 63 Left 2
SYMATTR InstName A33
SYMBOL OpAmps\\UniversalOpAmp3 2512 1680 R0
WINDOW 0 -22 -3 Left 2
SYMATTR InstName U20
SYMBOL Digital\\inv 2016 1552 R0
SYMATTR InstName A34
SYMBOL Digital\\and 2272 1936 R0
WINDOW 0 -26 63 Left 2
SYMATTR InstName A35
SYMBOL Digital\\and 2272 2016 R0
WINDOW 0 -26 63 Left 2
SYMATTR InstName A36
SYMBOL Digital\\and 2272 2096 R0
WINDOW 0 -26 63 Left 2
SYMATTR InstName A37
SYMBOL Digital\\and 2272 2176 R0
WINDOW 0 -26 63 Left 2
SYMATTR InstName A38
SYMBOL Digital\\inv 2128 1552 R0
SYMATTR InstName A39
SYMBOL Digital\\and 2272 2256 R0
WINDOW 0 -26 63 Left 2
SYMATTR InstName A40
SYMBOL Digital\\and 2272 2336 R0
WINDOW 0 -26 63 Left 2
SYMATTR InstName A41
SYMBOL OpAmps\\UniversalOpAmp3 2416 1760 R0
WINDOW 0 -22 -3 Left 2
SYMATTR InstName U21
SYMBOL OpAmps\\UniversalOpAmp3 2512 1840 R0
WINDOW 0 -22 -3 Left 2
SYMATTR InstName U22
SYMBOL OpAmps\\UniversalOpAmp3 2416 1920 R0
WINDOW 0 -22 -3 Left 2
SYMATTR InstName U23
SYMBOL OpAmps\\UniversalOpAmp3 2512 2000 R0
WINDOW 0 -22 -3 Left 2
SYMATTR InstName U24
SYMBOL OpAmps\\UniversalOpAmp3 2416 2080 R0
WINDOW 0 -22 -3 Left 2
SYMATTR InstName U25
SYMBOL OpAmps\\UniversalOpAmp3 2528 2160 R0
WINDOW 0 -22 -3 Left 2
SYMATTR InstName U26
SYMBOL OpAmps\\UniversalOpAmp3 2416 2240 R0
WINDOW 0 -22 -3 Left 2
SYMATTR InstName U27
SYMBOL OpAmps\\UniversalOpAmp3 2544 2320 R0
WINDOW 0 -22 -3 Left 2
SYMATTR InstName U28
SYMBOL OpAmps\\UniversalOpAmp3 2416 2400 R0
WINDOW 0 -22 -3 Left 2
SYMATTR InstName U29
SYMBOL Digital\\and 2272 2736 R0
WINDOW 0 -26 63 Left 2
SYMATTR InstName A42
SYMBOL Digital\\and 2272 2816 R0
WINDOW 0 -26 63 Left 2
SYMATTR InstName A43
SYMBOL OpAmps\\UniversalOpAmp3 2544 2800 R0
WINDOW 0 -22 -3 Left 2
SYMATTR InstName U30
SYMBOL OpAmps\\UniversalOpAmp3 2416 2880 R0
WINDOW 0 -22 -3 Left 2
SYMATTR InstName U31
SYMBOL Digital\\and 2272 2416 R0
WINDOW 0 -26 63 Left 2
SYMATTR InstName A44
SYMBOL Digital\\and 2272 2496 R0
WINDOW 0 -26 63 Left 2
SYMATTR InstName A45
SYMBOL OpAmps\\UniversalOpAmp3 2544 2480 R0
WINDOW 0 -22 -3 Left 2
SYMATTR InstName U32
SYMBOL OpAmps\\UniversalOpAmp3 2416 2560 R0
WINDOW 0 -22 -3 Left 2
SYMATTR InstName U33
SYMBOL Digital\\and 2272 2576 R0
WINDOW 0 -26 63 Left 2
SYMATTR InstName A46
SYMBOL Digital\\and 2272 2656 R0
WINDOW 0 -26 63 Left 2
SYMATTR InstName A47
SYMBOL OpAmps\\UniversalOpAmp3 2544 2640 R0
WINDOW 0 -22 -3 Left 2
SYMATTR InstName U34
SYMBOL OpAmps\\UniversalOpAmp3 2416 2720 R0
WINDOW 0 -22 -3 Left 2
SYMATTR InstName U35
SYMBOL Misc\\battery 2800 1792 R0
WINDOW 0 14 18 Left 2
WINDOW 3 13 90 Left 2
WINDOW 123 0 0 Left 0
WINDOW 39 0 0 Left 0
SYMATTR InstName V5
SYMATTR Value 2V
SYMBOL Misc\\battery 2880 1792 R0
WINDOW 0 14 18 Left 2
WINDOW 3 13 90 Left 2
SYMATTR InstName V6
SYMATTR Value 3V
SYMBOL Misc\\battery 2960 1792 R0
WINDOW 0 14 18 Left 2
WINDOW 3 13 90 Left 2
SYMATTR InstName V7
SYMATTR Value 4V
SYMBOL Misc\\battery 3040 1792 R0
WINDOW 0 14 18 Left 2
WINDOW 3 13 90 Left 2
SYMATTR InstName V8
SYMATTR Value 5V
SYMBOL Misc\\battery 3120 1792 R0
WINDOW 0 14 18 Left 2
WINDOW 3 13 90 Left 2
SYMATTR InstName V9
SYMATTR Value 6V
SYMBOL Misc\\battery 3200 1792 R0
WINDOW 0 14 18 Left 2
WINDOW 3 13 90 Left 2
SYMATTR InstName V10
SYMATTR Value 7V
SYMBOL Misc\\battery 3280 1792 R0
WINDOW 0 14 18 Left 2
WINDOW 3 13 90 Left 2
SYMATTR InstName V11
SYMATTR Value 8V
SYMBOL Misc\\battery 3360 1792 R0
WINDOW 0 14 18 Left 2
WINDOW 3 13 90 Left 2
SYMATTR InstName V12
SYMATTR Value 9V
SYMBOL Misc\\battery 3440 1792 R0
WINDOW 0 14 18 Left 2
WINDOW 3 13 90 Left 2
SYMATTR InstName V13
SYMATTR Value 10V
SYMBOL Misc\\battery 3520 1792 R0
WINDOW 0 14 18 Left 2
WINDOW 3 13 90 Left 2
SYMATTR InstName V14
SYMATTR Value 11V
SYMBOL Misc\\battery 3600 1792 R0
WINDOW 0 14 18 Left 2
WINDOW 3 13 90 Left 2
SYMATTR InstName V15
SYMATTR Value 12V
SYMBOL Misc\\battery 3680 1792 R0
WINDOW 0 14 18 Left 2
WINDOW 3 13 90 Left 2
SYMATTR InstName V16
SYMATTR Value 13V
SYMBOL Misc\\battery 3760 1792 R0
WINDOW 0 14 18 Left 2
WINDOW 3 13 90 Left 2
SYMATTR InstName V17
SYMATTR Value 14V
SYMBOL Misc\\battery 3840 1792 R0
WINDOW 0 14 18 Left 2
WINDOW 3 13 90 Left 2
SYMATTR InstName V18
SYMATTR Value 15V
SYMBOL Misc\\battery 2720 1792 R0
WINDOW 0 14 18 Left 2
WINDOW 3 13 90 Left 2
SYMATTR InstName V19
SYMATTR Value 1V
TEXT -232 56 Left 3 ;EBA2201r.asc: Elektronik simülasyon 36 temrini örneği.
TEXT -232 96 Left 2 ;01-5n • Temrin-36: DAC ve ADC Devreleri. Girişindeki ikilik mantık sinyali onluk örneksel sinyale (örn.Volt) çeviren devrelere digital-analog\n    converter (DAC) devresi denir. Girişindeki onluk örneksel sinyali (örn.Volt) sinyali ikilik mantık sinyale çeviren devrelere analog-digital\n     converter (ADC) devresi denir.\n    -Sağdaki ilk ADC devrede örneksel Vgir=1V-->15V, çıktıda 4 bitli sayısal 0001-->1111 sinyal (Iled=17.2mA) üretir. (Vgir=0V için 0000\n    yerine Iled=3.2mA ile hatalı 1111 sinyal vermektedir, düzelt.)\n    -Sağdaki ikinci DAC devrede Vgir=0000-->1111 için analog Vçık=0V-->15V üretir.
TEXT 2008 912 Left 2 !.tran 0 1mS 0
TEXT 4024 1264 Right 2 ;1
TEXT 4024 1184 Right 2 ;2
TEXT 4024 1104 Right 2 ;4
TEXT 4024 1024 Right 2 ;8
TEXT 1872 320 VRight 2 ;1
TEXT 2056 320 VRight 2 ;2
TEXT 2360 328 VRight 2 ;4
TEXT 2992 328 VRight 2 ;8
TEXT 2216 320 VRight 2 ;3
TEXT 2520 320 VRight 2 ;5
TEXT 2672 320 VRight 2 ;6
TEXT 2832 328 VRight 2 ;7
TEXT 3152 320 VRight 2 ;9
TEXT 3312 320 VRight 2 ;10
TEXT 3488 328 VRight 2 ;11
TEXT 3640 336 VRight 2 ;12
TEXT 3808 336 VRight 2 ;13
TEXT 3952 336 VRight 2 ;14
TEXT 4152 344 VRight 2 ;15
TEXT 3208 832 Left 2 ;Örnekler:\n1V=0001\n6V=0110\n13V=1101
TEXT 1784 1552 Left 2 ;B3
TEXT 1896 1552 Left 2 ;B2
TEXT 2008 1552 Left 2 ;B1
TEXT 2120 1552 Left 2 ;B0
TEXT 2448 1896 Left 2 ;Vçık
TEXT 2448 2056 Left 2 ;Vçık
TEXT 2592 1656 Left 2 ;0V
TEXT 2592 1744 Left 2 ;1V
TEXT 2592 1816 Left 2 ;2V
TEXT 2584 1896 Left 2 ;3V
TEXT 2584 1976 Left 2 ;4V
TEXT 2584 2064 Left 2 ;5V
TEXT 2592 2136 Left 2 ;6V
TEXT 2592 2224 Left 2 ;7V
TEXT 2592 2304 Left 2 ;8V
TEXT 2592 2384 Left 2 ;9V
TEXT 2440 1608 Left 2 ;Analog Çıkışlar
TEXT 1784 1416 Left 2 ;İkilik Girişler
TEXT 2592 2784 Left 2 ;14V
TEXT 2592 2864 Left 2 ;15V
TEXT 2592 2464 Left 2 ;10V
TEXT 2592 2544 Left 2 ;11V
TEXT 2592 2624 Left 2 ;12V
TEXT 2592 2704 Left 2 ;13V
TEXT 1664 40 Left 2 ;Vgir
RECTANGLE Normal 2320 2960 1760 1568 2

The netlist it stands for:
* EBA2201r.asc
V2 V20+ 0 20V
V1 V0 0 0V
R1 N062 N061 1kΩ
R2 N064 N063 1kΩ
R3 N066 N065 1kΩ
R4 N060 N059 1kΩ
A1 0 0 N035 N032 N036 0 N047 0 OR
A2 0 0 N035 N033 N036 0 N048 0 OR
A3 N034 N040 N041 N042 N043 0 N053 0 OR
A4 N034 N036 N037 N038 N039 0 N054 0 OR
A5 0 0 N035 N033 N032 0 N050 0 OR
A6 N038 N040 N042 N044 N046 0 N051 0 OR
A7 N037 N040 N041 N044 N045 0 N052 0 OR
A8 0 0 N035 N033 N032 0 N049 0 OR
R5 N015 N014 1k
R6 N013 N012 1k
R7 N012 N011 1k
R8 N011 N010 1k
R9 N010 N009 1k
R10 N009 N008 1k
R11 N008 N007 1k
R12 N007 N006 1k
R13 N006 N005 1k
R14 N005 N004 1k
R15 N004 N003 1k
R16 N003 N002 1k
R17 N002 N001 1k
R18 N001 0 1k
Vref1 N015 0 15.1V
R19 N014 N013 1k
V4 N016 0 0V
XU1 N016 0 V1+ V0 N017 level1 Avol=1Meg GBW=10Meg Vos=0 En=0 Enk=0 In=0 Ink=0 Rin=500Meg  ; pins In+ In- V+ V- OUT
XU2 N016 N001 V1+ V0 N018 level1 Avol=1Meg GBW=10Meg Vos=0 En=0 Enk=0 In=0 Ink=0 Rin=500Meg  ; pins In+ In- V+ V- OUT
XU3 N016 N002 V1+ V0 N019 level1 Avol=1Meg GBW=10Meg Vos=0 En=0 Enk=0 In=0 Ink=0 Rin=500Meg  ; pins In+ In- V+ V- OUT
XU4 N016 N003 V1+ V0 N020 level1 Avol=1Meg GBW=10Meg Vos=0 En=0 Enk=0 In=0 Ink=0 Rin=500Meg  ; pins In+ In- V+ V- OUT
XU5 N016 N004 V1+ V0 N021 level1 Avol=1Meg GBW=10Meg Vos=0 En=0 Enk=0 In=0 Ink=0 Rin=500Meg  ; pins In+ In- V+ V- OUT
XU6 N016 N005 V1+ V0 N022 level1 Avol=1Meg GBW=10Meg Vos=0 En=0 Enk=0 In=0 Ink=0 Rin=500Meg  ; pins In+ In- V+ V- OUT
XU7 N016 N006 V1+ V0 N023 level1 Avol=1Meg GBW=10Meg Vos=0 En=0 Enk=0 In=0 Ink=0 Rin=500Meg  ; pins In+ In- V+ V- OUT
XU8 N016 N007 V1+ V0 N024 level1 Avol=1Meg GBW=10Meg Vos=0 En=0 Enk=0 In=0 Ink=0 Rin=500Meg  ; pins In+ In- V+ V- OUT
XU9 N016 N008 V1+ V0 N025 level1 Avol=1Meg GBW=10Meg Vos=0 En=0 Enk=0 In=0 Ink=0 Rin=500Meg  ; pins In+ In- V+ V- OUT
XU10 N016 N009 V1+ V0 N026 level1 Avol=1Meg GBW=10Meg Vos=0 En=0 Enk=0 In=0 Ink=0 Rin=500Meg  ; pins In+ In- V+ V- OUT
XU11 N016 N010 V1+ V0 N027 level1 Avol=1Meg GBW=10Meg Vos=0 En=0 Enk=0 In=0 Ink=0 Rin=500Meg  ; pins In+ In- V+ V- OUT
XU12 N016 N011 V1+ V0 N028 level1 Avol=1Meg GBW=10Meg Vos=0 En=0 Enk=0 In=0 Ink=0 Rin=500Meg  ; pins In+ In- V+ V- OUT
XU13 N016 N012 V1+ V0 N029 level1 Avol=1Meg GBW=10Meg Vos=0 En=0 Enk=0 In=0 Ink=0 Rin=500Meg  ; pins In+ In- V+ V- OUT
XU14 N016 N013 V1+ V0 N030 level1 Avol=1Meg GBW=10Meg Vos=0 En=0 Enk=0 In=0 Ink=0 Rin=500Meg  ; pins In+ In- V+ V- OUT
XU15 N016 N014 V1+ V0 N031 level1 Avol=1Meg GBW=10Meg Vos=0 En=0 Enk=0 In=0 Ink=0 Rin=500Meg  ; pins In+ In- V+ V- OUT
A9 N018 0 0 0 N017 0 N046 0 XOR
A10 N019 0 0 0 N018 0 N045 0 XOR
A11 N020 0 0 0 N019 0 N044 0 XOR
A12 N021 0 0 0 N020 0 N043 0 XOR
A13 N022 0 0 0 N021 0 N042 0 XOR
A14 N023 0 0 0 N022 0 N041 0 XOR
A15 N024 0 0 0 N023 0 N040 0 XOR
A16 N025 0 0 0 N024 0 N039 0 XOR
A17 N026 0 0 0 N025 0 N038 0 XOR
A18 N027 0 0 0 N026 0 N037 0 XOR
A19 N028 0 0 0 N027 0 N036 0 XOR
A20 N029 0 0 0 N028 0 N034 0 XOR
A21 N030 0 0 0 N029 0 N032 0 XOR
A22 N031 0 0 0 N030 0 N033 0 XOR
A23 V0 0 0 0 N031 0 N035 0 XOR
A24 N047 0 0 0 N051 0 N055 0 OR
A25 N048 0 0 0 N052 0 N056 0 OR
A26 N049 0 0 0 N053 0 N057 0 OR
A27 N050 0 0 0 N054 0 N058 0 OR
D1 N059 0 AOT-2015
D2 N061 0 AOT-2015
D3 N063 0 AOT-2015
D4 N065 0 AOT-2015
* U16: UniversalOpAmp4 (symbol OpAmps\UniversalOpAmp4 not available, pins judged from their places): In+=N058 In-=0 V+=V20+ V-=0 OUT=N060
* U17: UniversalOpAmp4 (symbol OpAmps\UniversalOpAmp4 not available, pins judged from their places): In+=N057 In-=0 V+=V20+ V-=0 OUT=N062
* U18: UniversalOpAmp4 (symbol OpAmps\UniversalOpAmp4 not available, pins judged from their places): In+=N056 In-=0 V+=V20+ V-=0 OUT=N064
* U19: UniversalOpAmp4 (symbol OpAmps\UniversalOpAmp4 not available, pins judged from their places): In+=N055 In-=0 V+=V20+ V-=0 OUT=N066
A28 N067 N068 N069 N070 N070 0 N071 0 AND
A29 V1+ 0 0 0 0 N067 0 0 BUF
A30 V1+ 0 0 0 0 N068 0 0 BUF
A31 N067 N068 N069 V1+ V1+ 0 N073 0 AND
A32 N067 N068 V1+ N070 N070 0 N075 0 AND
A33 N067 N068 V1+ V1+ V1+ 0 N077 0 AND
XU20 N071 0 0 0 N072 level3a  ; pins In+ In- V+ V- OUT
A34 V1+ 0 0 0 0 N069 0 0 BUF
A35 N067 V1+ N069 N070 N070 0 N079 0 AND
A36 N067 V1+ N069 V1+ V1+ 0 N081 0 AND
A37 N067 V1+ V1+ N070 N070 0 N083 0 AND
A38 N067 V1+ V1+ V1+ V1+ 0 N085 0 AND
A39 V1+ 0 0 0 0 N070 0 0 BUF
A40 V1+ N068 N069 N070 N070 0 N087 0 AND
A41 V1+ N068 N069 V1+ V1+ 0 N089 0 AND
XU21 N073 0 V1+ 0 N074 level3a  ; pins In+ In- V+ V- OUT
XU22 N075 0 V2+ 0 N076 level3a  ; pins In+ In- V+ V- OUT
XU23 N077 0 V3+ 0 N078 level3a  ; pins In+ In- V+ V- OUT
XU24 N079 0 V4+ 0 N080 level3a  ; pins In+ In- V+ V- OUT
XU25 N081 0 V5+ 0 N082 level3a  ; pins In+ In- V+ V- OUT
XU26 N083 0 V6+ 0 N084 level3a  ; pins In+ In- V+ V- OUT
XU27 N085 0 V7+ 0 N086 level3a  ; pins In+ In- V+ V- OUT
XU28 N087 0 V8+ 0 N088 level3a  ; pins In+ In- V+ V- OUT
XU29 N089 0 V9+ 0 N090 level3a  ; pins In+ In- V+ V- OUT
A42 V1+ N070 N070 V1+ V1+ 0 N099 0 AND
A43 V1+ V1+ V1+ V1+ V1+ 0 N101 0 AND
XU30 N099 0 V14+ 0 N100 level3a  ; pins In+ In- V+ V- OUT
XU31 N101 0 V15+ 0 N102 level3a  ; pins In+ In- V+ V- OUT
A44 V1+ N068 N070 N070 V1+ 0 N091 0 AND
A45 V1+ N068 N068 V1+ V1+ 0 N093 0 AND
XU32 N091 0 V10+ 0 N092 level3a  ; pins In+ In- V+ V- OUT
XU33 N093 0 V11+ 0 N094 level3a  ; pins In+ In- V+ V- OUT
A46 V1+ N069 N070 N070 V1+ 0 N095 0 AND
A47 V1+ N069 N069 V1+ V1+ 0 N097 0 AND
XU34 N095 0 V12+ 0 N096 level3a  ; pins In+ In- V+ V- OUT
XU35 N097 0 V13+ 0 N098 level3a  ; pins In+ In- V+ V- OUT
V5 V2+ 0 2V
V6 V3+ 0 3V
V7 V4+ 0 4V
V8 V5+ 0 5V
V9 V6+ 0 6V
V10 V7+ 0 7V
V11 V8+ 0 8V
V12 V9+ 0 9V
V13 V10+ 0 10V
V14 V11+ 0 11V
V15 V12+ 0 12V
V16 V13+ 0 13V
V17 V14+ 0 14V
V18 V15+ 0 15V
V19 V1+ 0 1V
.model D D
.lib standard.dio
* EBA2201r.asc: Elektronik simülasyon 36 temrini örneği.
* 01-5n • Temrin-36: DAC ve ADC Devreleri. Girişindeki ikilik mantık sinyali onluk örneksel sinyale (örn.Volt) çeviren devrelere digital-analog
*     converter (DAC) devresi denir. Girişindeki onluk örneksel sinyali (örn.Volt) sinyali ikilik mantık sinyale çeviren devrelere analog-digital
*      converter (ADC) devresi denir.
*     -Sağdaki ilk ADC devrede örneksel Vgir=1V-->15V, çıktıda 4 bitli sayısal 0001-->1111 sinyal (Iled=17.2mA) üretir. (Vgir=0V için 0000
*     yerine Iled=3.2mA ile hatalı 1111 sinyal vermektedir, düzelt.)
*     -Sağdaki ikinci DAC devrede Vgir=0000-->1111 için analog Vçık=0V-->15V üretir.
.tran 0 1mS 0
* 1
* 2
* 4
* 8
* 1
* 2
* 4
* 8
* 3
* 5
* 6
* 7
* 9
* 10
* 11
* 12
* 13
* 14
* 15
* Örnekler:
* 1V=0001
* 6V=0110
* 13V=1101
* B3
* B2
* B1
* B0
* Vçık
* Vçık
* 0V
* 1V
* 2V
* 3V
* 4V
* 5V
* 6V
* 7V
* 8V
* 9V
* Analog Çıkışlar
* İkilik Girişler
* 14V
* 15V
* 10V
* 11V
* 12V
* 13V
* Vgir
.lib UniversalOpAmp1.lib
.backanno
.end